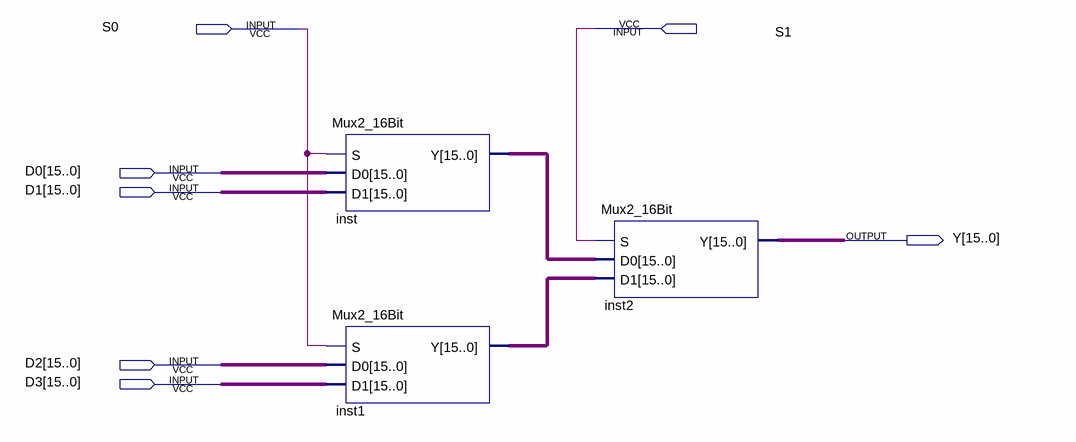
[diagram p0: schematic sheet]
// Quartus schematic Mux4_16Bit.bdf as structural Verilog: 3 symbols, 7 pins
module Mux4_16Bit (
  input  S0,
  input  S1,
  input  [15:0] D0,
  input  [15:0] D1,
  input  [15:0] D2,
  input  [15:0] D3,
  output [15:0] Y
);

  wire [15:0] inst1_y, inst_y;

  Mux2_16Bit inst (.S(S0), .D0(D0), .D1(D1), .Y(inst_y));
  Mux2_16Bit inst1 (.S(S0), .D0(D2), .D1(D3), .Y(inst1_y));
  Mux2_16Bit inst2 (.S(S1), .D0(inst_y), .D1(inst1_y), .Y(Y));
endmodule
